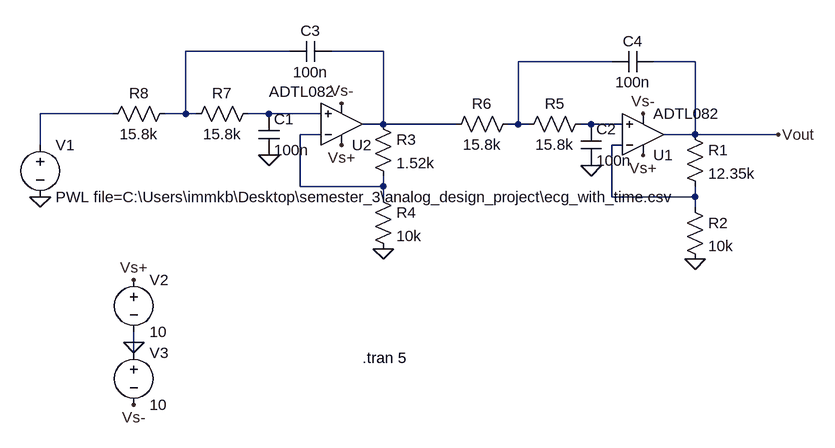
[diagram p0: schematic low_pass_filter.asc]
low_pass_filter.asc, the LTspice schematic file:
Version 4.1
SHEET 1 1008 744
WIRE -272 48 -432 48
WIRE -128 48 -208 48
WIRE 224 64 80 64
WIRE 352 64 288 64
WIRE -544 144 -656 144
WIRE -432 144 -432 48
WIRE -432 144 -464 144
WIRE -416 144 -432 144
WIRE -304 144 -336 144
WIRE -224 144 -304 144
WIRE -128 160 -128 48
WIRE -128 160 -160 160
WIRE -16 160 -128 160
WIRE 80 160 80 64
WIRE 80 160 64 160
WIRE 96 160 80 160
WIRE 192 160 176 160
WIRE 240 160 192 160
WIRE -224 176 -256 176
WIRE 352 176 352 64
WIRE 352 176 304 176
WIRE 480 176 352 176
WIRE -656 192 -656 144
WIRE 240 192 224 192
WIRE -256 256 -256 176
WIRE -128 256 -128 240
WIRE -128 256 -256 256
WIRE -128 272 -128 256
WIRE 224 272 224 192
WIRE 352 272 352 256
WIRE 352 272 224 272
WIRE 352 288 352 272
WIRE -512 496 -512 480
WIRE -512 512 -512 496
FLAG 352 368 0
FLAG -128 352 0
FLAG -304 208 0
FLAG 192 224 0
FLAG -656 272 0
FLAG -512 496 0
FLAG -512 400 Vs+
FLAG -512 592 Vs-
FLAG -192 128 Vs-
FLAG 272 144 Vs-
FLAG -192 192 Vs+
FLAG 272 208 Vs+
FLAG 480 176 Vout
SYMBOL OpAmps\\ADTL082 272 240 M180
SYMATTR InstName U1
SYMBOL OpAmps\\ADTL082 -192 224 M180
WINDOW 3 -112 114 Left 2
SYMATTR InstName U2
SYMBOL res 336 160 R0
SYMATTR InstName R1
SYMATTR Value 12.35k
SYMBOL res 336 272 R0
SYMATTR InstName R2
SYMATTR Value 10k
SYMBOL res -144 144 R0
SYMATTR InstName R3
SYMATTR Value 1.52k
SYMBOL res -144 256 R0
SYMATTR InstName R4
SYMATTR Value 10k
SYMBOL cap -320 144 R0
SYMATTR InstName C1
SYMATTR Value 100n
SYMBOL cap 176 160 R0
SYMATTR InstName C2
SYMATTR Value 100n
SYMBOL res 192 144 R90
WINDOW 0 0 56 VBottom 2
WINDOW 3 32 56 VTop 2
SYMATTR InstName R5
SYMATTR Value 15.8k
SYMBOL res 80 144 R90
WINDOW 0 0 56 VBottom 2
WINDOW 3 32 56 VTop 2
SYMATTR InstName R6
SYMATTR Value 15.8k
SYMBOL res -320 128 R90
WINDOW 0 0 56 VBottom 2
WINDOW 3 32 56 VTop 2
SYMATTR InstName R7
SYMATTR Value 15.8k
SYMBOL res -448 128 R90
WINDOW 0 0 56 VBottom 2
WINDOW 3 32 56 VTop 2
SYMATTR InstName R8
SYMATTR Value 15.8k
SYMBOL cap -208 32 R90
WINDOW 0 0 32 VBottom 2
WINDOW 3 32 32 VTop 2
SYMATTR InstName C3
SYMATTR Value 100n
SYMBOL cap 288 48 R90
WINDOW 0 0 32 VBottom 2
WINDOW 3 32 32 VTop 2
SYMATTR InstName C4
SYMATTR Value 100n
SYMBOL voltage -512 384 R0
WINDOW 123 0 0 Left 0
WINDOW 39 0 0 Left 0
SYMATTR InstName V2
SYMATTR Value 10
SYMBOL voltage -512 496 R0
WINDOW 123 0 0 Left 0
WINDOW 39 0 0 Left 0
SYMATTR InstName V3
SYMATTR Value 10
SYMBOL voltage -656 176 R0
WINDOW 123 0 0 Left 0
WINDOW 39 0 0 Left 0
SYMATTR InstName V1
SYMATTR Value PWL file=C:\Users\immkb\Desktop\semester_3\analog_design_project\ecg_with_time.csv
TEXT -160 520 Left 2 !.tran 5

The netlist it stands for:
* low_pass_filter.asc
X§U1 N006 N008 Vs+ Vs- Vout ADTL082  ; pins In+ In- V+ V- OUT
X§U2 N005 N007 Vs+ Vs- N002 ADTL082  ; pins In+ In- V+ V- OUT
R1 Vout N008 12.35k
R2 N008 0 10k
R3 N002 N007 1.52k
R4 N007 0 10k
C1 N005 0 100n
C2 N006 0 100n
R5 N006 N003 15.8k
R6 N003 N002 15.8k
R7 N005 N001 15.8k
R8 N001 N004 15.8k
C3 N002 N001 100n
C4 Vout N003 100n
V2 Vs+ 0 10
V3 0 Vs- 10
V1 N004 0 PWL file=C:\Users\immkb\Desktop\semester_3\analog_design_project\ecg_with_time.csv
.tran 5
.lib ADI.lib
.backanno
.end